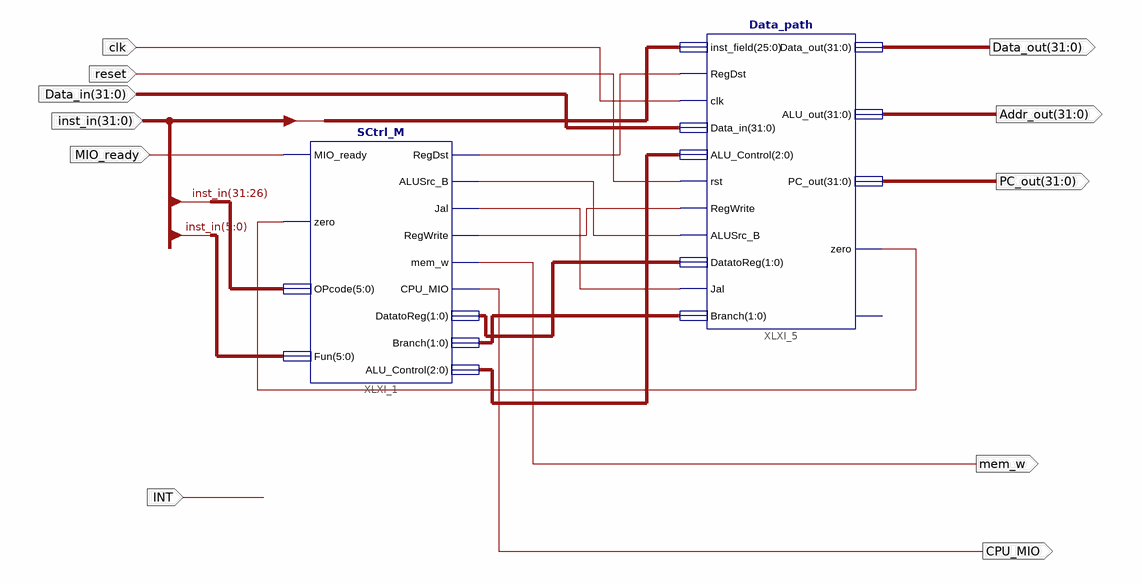
[diagram p0: schematic sheet 1]
// Xilinx ISE schematic SCPU.sch (kintex7) as structural Verilog: 2 symbols, 11 ports
module SCPU (
  input  MIO_ready,
  input  INT,
  input  [31:0] Data_in,
  input  reset,
  input  clk,
  input  [31:0] inst_in,
  output mem_w,
  output CPU_MIO,
  output [31:0] PC_out,
  output [31:0] Addr_out,
  output [31:0] Data_out
);

  wire XLXN_15, XLXN_16, XLXN_21, XLXN_22, XLXN_30;
  wire [1:0] XLXN_17, XLXN_19;
  wire [2:0] XLXN_20;

  SCtrl_M XLXI_1 (
    .MIO_ready(MIO_ready), .zero(XLXN_30), .OPcode(inst_in[31:26]), .Fun(inst_in[5:0]), .RegDst(XLXN_15),
    .ALUSrc_B(XLXN_22), .Jal(XLXN_16), .RegWrite(XLXN_21), .mem_w(mem_w), .CPU_MIO(CPU_MIO),
    .DatatoReg(XLXN_19), .Branch(XLXN_17), .ALU_Control(XLXN_20));
  Data_path XLXI_5 (
    .inst_field(inst_in[25:0]), .RegDst(XLXN_15), .clk(clk), .Data_in(Data_in), .ALU_Control(XLXN_20),
    .rst(reset), .RegWrite(XLXN_21), .ALUSrc_B(XLXN_22), .DatatoReg(XLXN_19), .Jal(XLXN_16),
    .Branch(XLXN_17), .Data_out(Data_out), .ALU_out(Addr_out), .PC_out(PC_out), .zero(XLXN_30));  // open: overflow
endmodule
